# EAGLE design carte_decodeur (EAGLE 6.1)
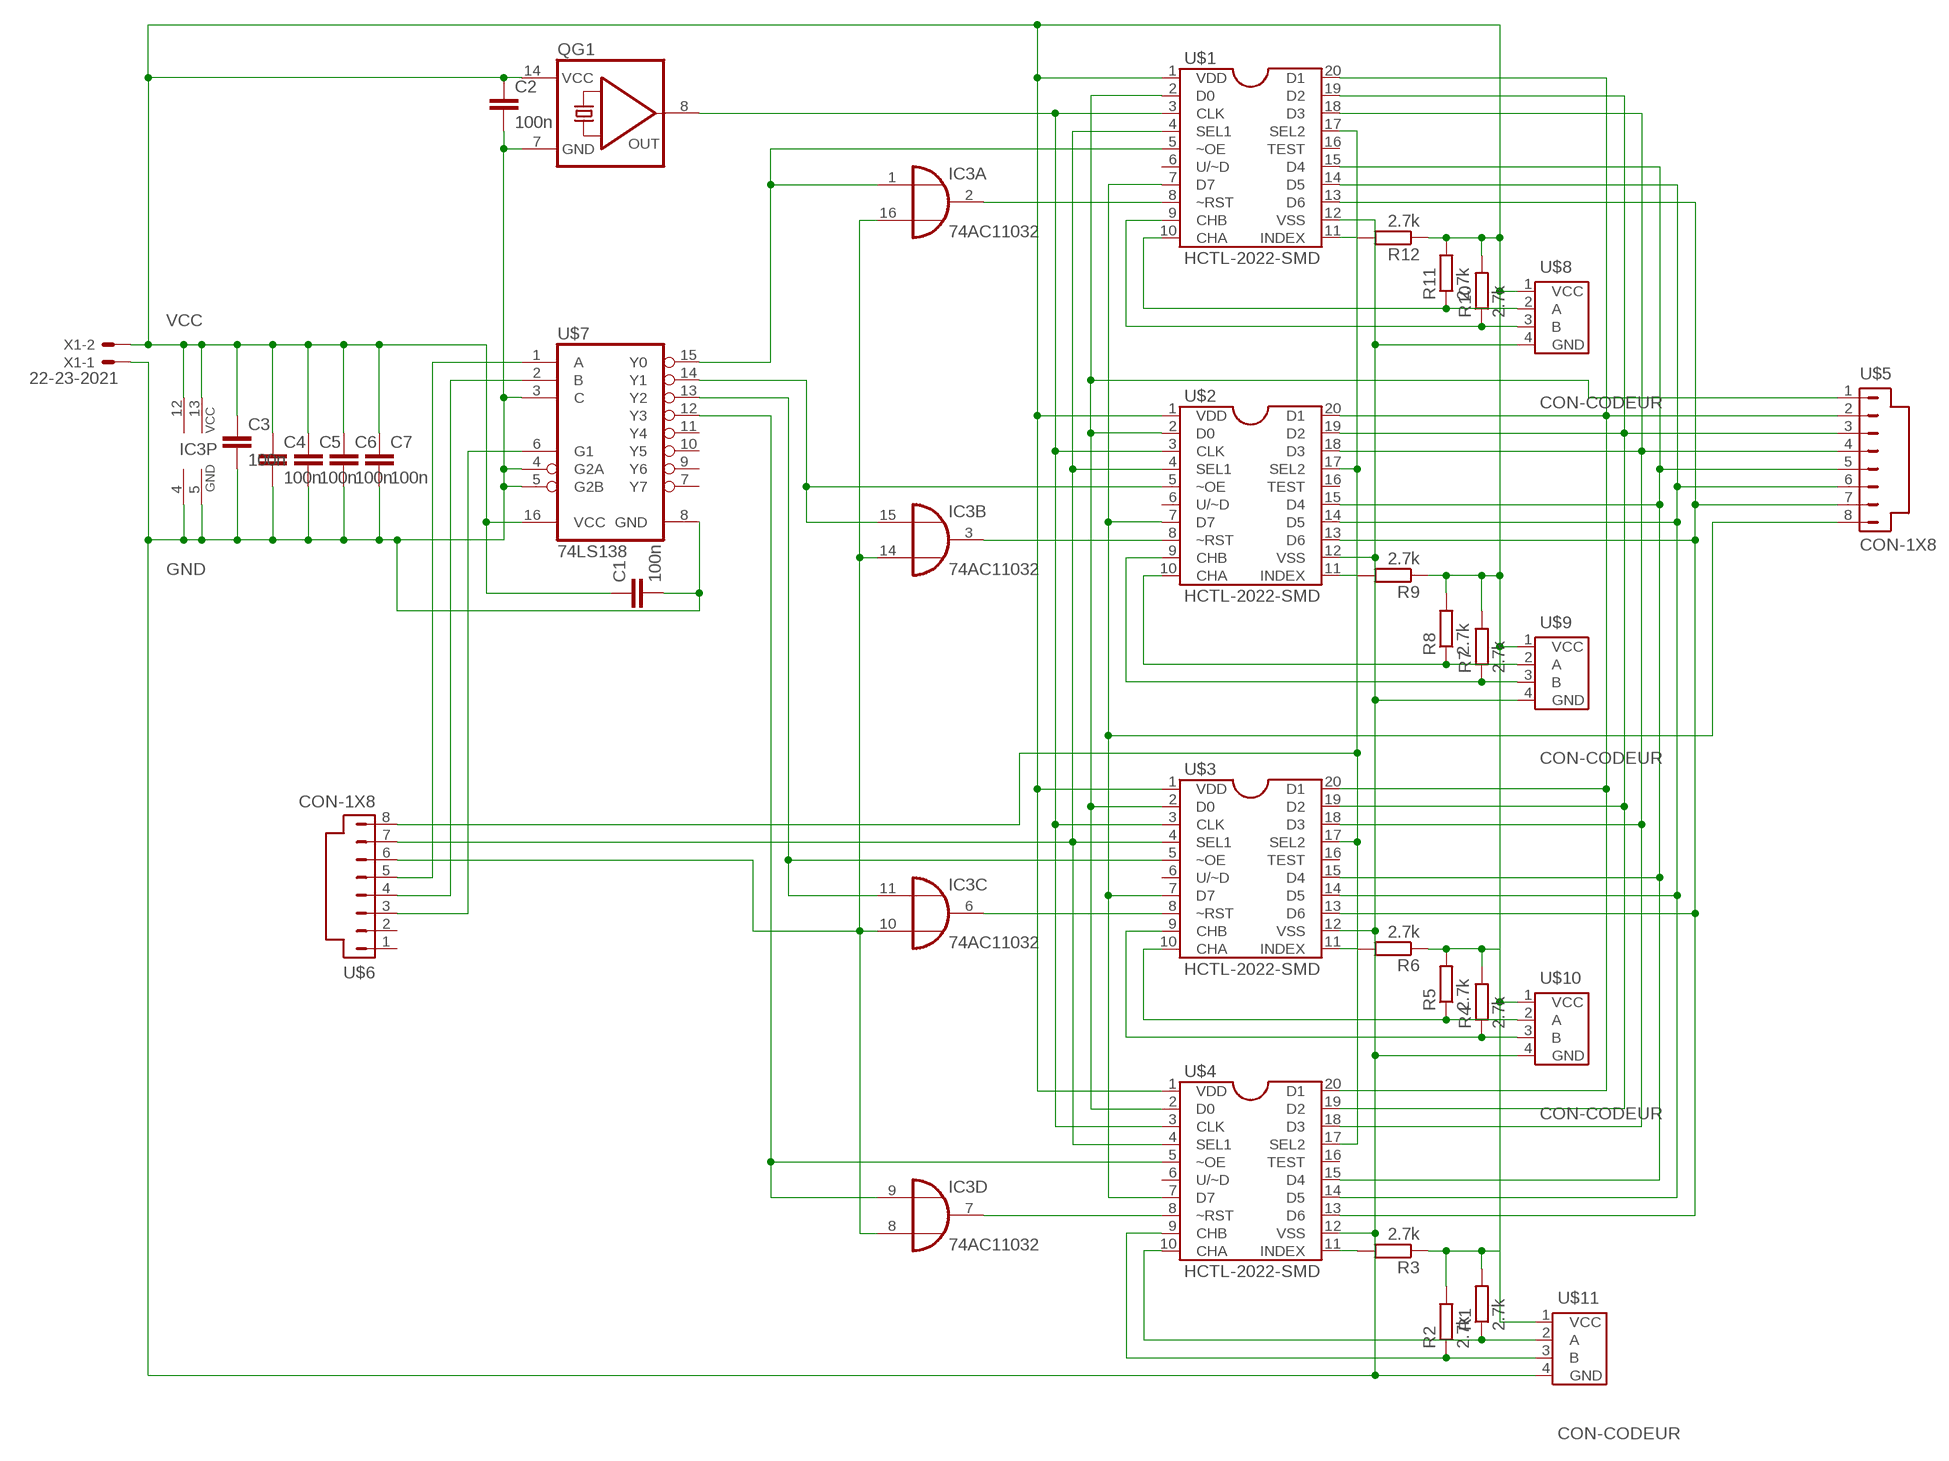
[diagram p0: schematic, sheet 1]

## Parts
C1  100n  C-EUC0805  [C0805]
C2  100n  C-EUC0805  [C0805]
C3  100n  C-EUC0805  [C0805]
C4  100n  C-EUC0805  [C0805]
C5  100n  C-EUC0805  [C0805]
C6  100n  C-EUC0805  [C0805]
C7  100n  C-EUC0805  [C0805]
IC3  74AC11032  [DIL16]
QG1  QG5860  [DIL14S]
R1  2.7k  R-EU_R0805  [R0805]
R2  2.7k  R-EU_R0805  [R0805]
R3  2.7k  R-EU_R0805  [R0805]
R4  2.7k  R-EU_R0805  [R0805]
R5  2.7k  R-EU_R0805  [R0805]
R6  2.7k  R-EU_R0805  [R0805]
R7  2.7k  R-EU_R0805  [R0805]
R8  2.7k  R-EU_R0805  [R0805]
R9  2.7k  R-EU_R0805  [R0805]
R10  2.7k  R-EU_R0805  [R0805]
R11  2.7k  R-EU_R0805  [R0805]
R12  2.7k  R-EU_R0805  [R0805]
U$1  HCTL-2022-SMD  [DIL20-SMD]
U$2  HCTL-2022-SMD  [DIL20-SMD]
U$3  HCTL-2022-SMD  [DIL20-SMD]
U$4  HCTL-2022-SMD  [DIL20-SMD]
U$5  CON-1X8  [CON-1X8]
U$6  CON-1X8  [CON-1X8]
U$7  74LS138  [DIL16]
U$8  CON-CODEUR  [CON-1X4]
U$9  CON-CODEUR  [CON-1X4]
U$10  CON-CODEUR  [CON-1X4]
U$11  CON-CODEUR  [CON-1X4]
X1  22-23-2021  [22-23-2021]

## Nets
GND: C1.2 C2.2 C3.2 C4.2 C5.2 C6.2 C7.2 IC3.4(P:GND) IC3.5(P:GND) QG1.7(GND) U$1.12(VSS) U$2.12(VSS) U$3.12(VSS) U$4.12(VSS) U$7.3(C) U$7.4(G2A) U$7.5(G2B) U$7.8(GND) U$8.4(GND) U$9.4(GND) U$10.4(GND) U$11.4(GND) X1.1
N$1: U$1.15(D4) U$2.15(D4) U$3.15(D4) U$4.15(D4) U$5.5
N$2: U$1.19(D2) U$2.19(D2) U$3.19(D2) U$4.19(D2) U$5.3
N$3: U$1.18(D3) U$2.18(D3) U$3.18(D3) U$4.18(D3) U$5.4
N$4: IC3.1(A:I1) U$1.5(~OE) U$7.15(Y0)
N$5: IC3.15(B:I1) U$2.5(~OE) U$7.14(Y1)
N$6: U$1.13(D6) U$2.13(D6) U$3.13(D6) U$4.13(D6) U$5.7
N$7: U$1.7(D7) U$2.7(D7) U$3.7(D7) U$4.7(D7) U$5.8
N$8: U$1.2(D0) U$2.2(D0) U$3.2(D0) U$4.2(D0) U$5.1
N$9: U$1.20(D1) U$2.20(D1) U$3.20(D1) U$4.20(D1) U$5.2
N$10: IC3.11(C:I1) U$3.5(~OE) U$7.13(Y2)
N$11: IC3.9(D:I1) U$4.5(~OE) U$7.12(Y3)
N$12: U$1.4(SEL1) U$2.4(SEL1) U$3.4(SEL1) U$4.4(SEL1) U$6.7
N$13: U$1.17(SEL2) U$2.17(SEL2) U$3.17(SEL2) U$4.17(SEL2) U$6.8
N$14: U$1.14(D5) U$2.14(D5) U$3.14(D5) U$4.14(D5) U$5.6
N$15: U$6.5 U$7.1(A)
N$16: U$6.4 U$7.2(B)
N$17: IC3.7(D:O) U$4.8(~RST)
N$18: IC3.6(C:O) U$3.8(~RST)
N$19: IC3.3(B:O) U$2.8(~RST)
N$20: IC3.2(A:O) U$1.8(~RST)
N$21: U$6.3 U$7.6(G1)
N$22: IC3.8(D:I2) IC3.10(C:I2) IC3.14(B:I2) U$6.6
N$23: R1.1 U$4.10(CHA) U$11.2(A)
N$24: R2.1 U$4.9(CHB) U$11.3(B)
N$25: QG1.8(OUT) U$1.3(CLK) U$2.3(CLK) U$3.3(CLK) U$4.3(CLK)
N$26: R3.2 U$4.11(INDEX)
N$27: R5.1 U$3.10(CHA) U$10.2(A)
N$28: R4.1 U$3.9(CHB) U$10.3(B)
N$29: R6.2 U$3.11(INDEX)
N$30: R9.2 U$2.11(INDEX)
N$31: R8.1 U$2.10(CHA) U$9.2(A)
N$32: R7.1 U$2.9(CHB) U$9.3(B)
N$33: R12.2 U$1.11(INDEX)
N$35: R11.1 U$1.10(CHA) U$8.2(A)
N$39: R10.1 U$1.9(CHB) U$8.3(B)
VCC: C1.1 C2.1 C3.1 C4.1 C5.1 C6.1 C7.1 IC3.12(P:VCC) IC3.13(P:VCC) QG1.14(VCC) R1.2 R2.2 R3.1 R4.2 R5.2 R6.1 R7.2 R8.2 R9.1 R10.2 R11.2 R12.1 U$1.1(VDD) U$2.1(VDD) U$3.1(VDD) U$4.1(VDD) U$7.16(VCC) U$8.1(VCC) U$9.1(VCC) U$10.1(VCC) U$11.1(VCC) X1.2
Unconnected: IC3.16(A:I2) U$1.6(U/~D) U$1.16(TEST) U$2.6(U/~D) U$2.16(TEST) U$3.6(U/~D) U$3.16(TEST) U$4.6(U/~D) U$4.16(TEST) U$6.1 U$6.2 U$7.7(Y7) U$7.9(Y6) U$7.10(Y5) U$7.11(Y4)

## Library data of the parts
C1-C7 = rcl:C-EU: CAPACITOR, European symbol
IC3 = 74ac-logic:74AC11032: Quadruple 2-input OR
QG1 = crystal:QG5860: CRYSTAL RESONATOR; OC_FARNELL: unknown; OC_NEWARK: unknown
R1-R12 = rcl:R-EU_: RESISTOR, European symbol
U$1-U$4 = neobot:HCTL-2022-SMD
U$5 U$6 = neobot:CON-1X8
U$7 = neobot:74LS138
U$8-U$11 = neobot:CON-CODEUR
X1 = con-molex:22-23-2021: .100" (2.54mm) Center Header - 2 Pin; MF: MOLEX; MPN: 22-23-2021; OC_FARNELL: 1462926; OC_NEWARK: 25C3832

## Board
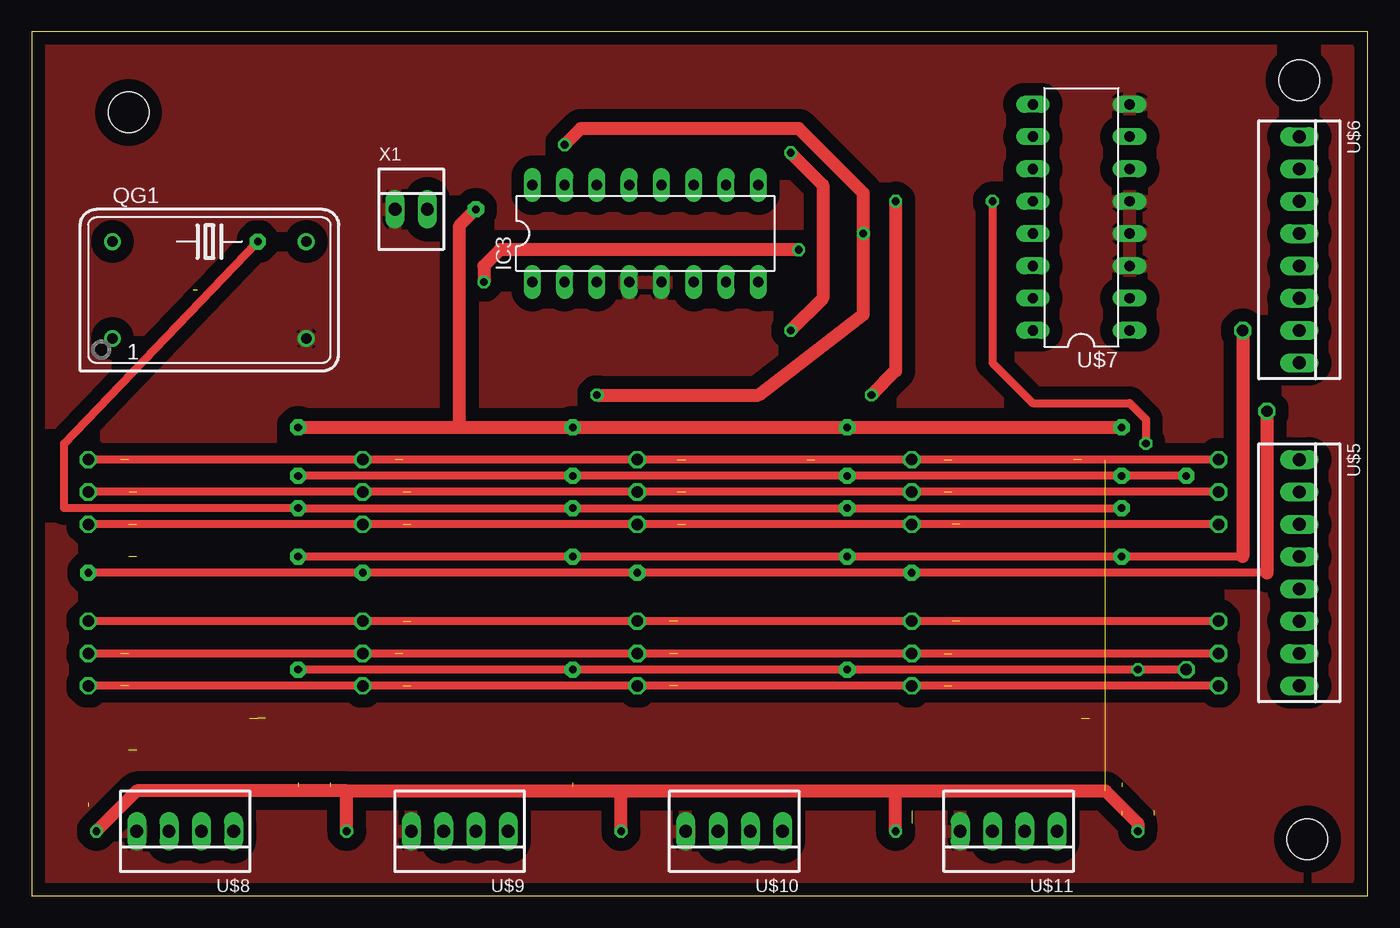
[diagram p1: board, top side]
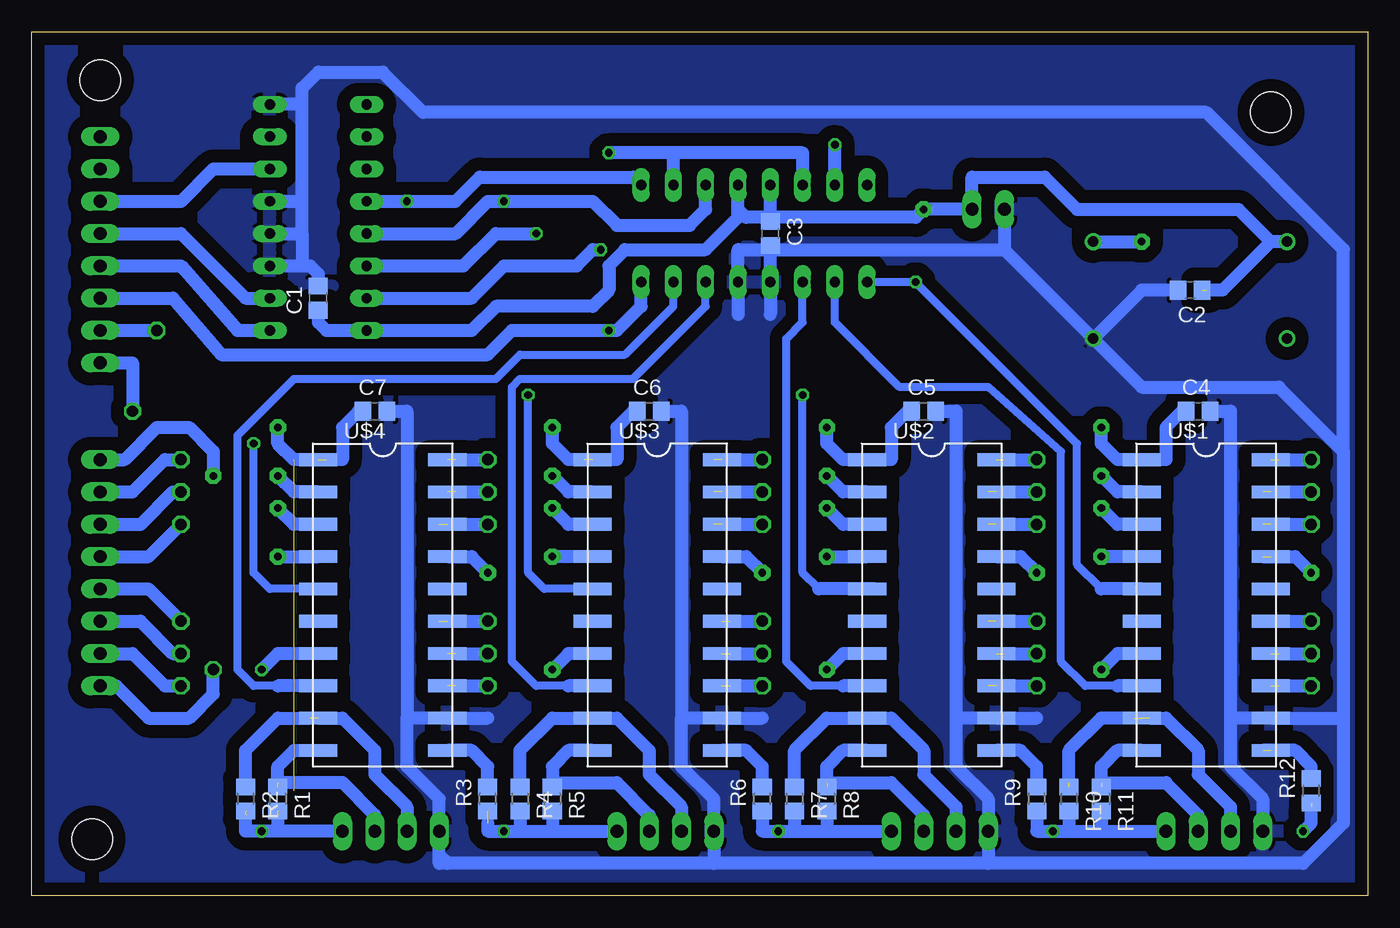
[diagram p2: board, bottom side, seen from below]

Size 105.08 x 67.94 mm. Coordinates in mm from the lower left corner, seen from the top.
Outline: 0,0 105.08,0 105.08,67.94 0,67.94 0,0
Copper layers (1*16): Top 0.035mm / dielectric 1.5mm / Bottom 0.035mm
Design rules: minimum track width 10mil, minimum drill 24mil, track to track 8mil, track to pad 8mil, pad to pad 8mil, via to via 8mil, smd to smd 8mil, copper to edge 40mil, drill to drill 8mil, minimum pad ring 10mil, minimum via ring 8mil, stop-mask expansion 4mil, vias tented up to drill 0mil, thermal gap 10mil
Holes 3.2 mm at 100.33,4.45 99.69,64.14 7.62,61.59

### Footprints (pad centres in the part's own frame; a part is rotated, then mirrored left to right if it is on the bottom)
C0805 = smd 1.3 x 1.5: 1 -0.95,0; 2 0.95,0
DIL16 = drill 0.813 long: 1 -8.89,-3.81; 2 -6.35,-3.81; 3 -3.81,-3.81; 4 -1.27,-3.81; 5 1.27,-3.81; 6 3.81,-3.81; 7 6.35,-3.81; 8 8.89,-3.81; 9 8.89,3.81; 10 6.35,3.81; 11 3.81,3.81; 12 1.27,3.81; 13 -1.27,3.81; 14 -3.81,3.81; 15 -6.35,3.81; 16 -8.89,3.81
DIL14S = drill 0.813: 1 -7.62,-3.81; 7 7.62,-3.81; 8 7.62,3.81; 14 -7.62,3.81
R0805 = smd 1.3 x 1.5: 1 -0.95,0; 2 0.95,0
DIL20-SMD = smd 1 x 3: 1 -11.43,-5.08; 2 -8.89,-5.08; 3 -6.35,-5.08; 4 -3.81,-5.08; 5 -1.27,-5.08; 6 1.27,-5.08; 7 3.81,-5.08; 8 6.35,-5.08; 9 8.89,-5.08; 10 11.43,-5.08; 11 11.43,5.08; 12 8.89,5.08; 13 6.35,5.08; 14 3.81,5.08; 15 1.27,5.08; 16 -1.27,5.08; 17 -3.81,5.08; 18 -6.35,5.08; 19 -8.89,5.08; 20 -11.43,5.08; P$2 11.43,5.08
CON-1X8 = drill 1 long: 1 -8.89,0; 2 -6.35,0; 3 -3.81,0; 4 -1.27,0; 5 1.27,0; 6 3.81,0; 7 6.35,0; 8 8.89,0
CON-1X4 = drill 1 long: 1 -3.81,0; 2 -1.27,0; 3 1.27,0; 4 3.81,0
22-23-2021 = drill 1 long: 1 -1.27,0; 2 1.27,0

### Placement (x,y rotation side)
C1  82.55,46.99 90 bottom
C2  13.97,47.62 180 bottom
C3  46.99,52.07 270 bottom
C4  13.34,38.1 0 bottom
C5  34.92,38.1 0 bottom
C6  56.52,38.1 0 bottom
C7  78.11,38.1 0 bottom
IC3  48.26,52.07 0 top
QG1  13.97,47.62 0 top
R1  85.72,7.62 270 bottom
R2  88.27,7.62 270 bottom
R3  69.22,7.62 90 bottom
R4  66.67,7.62 270 bottom
R5  64.14,7.62 270 bottom
R6  47.62,7.62 90 bottom
R7  45.09,7.62 270 bottom
R8  42.55,7.62 270 bottom
R9  26.04,7.62 90 bottom
R10  23.5,7.62 270 bottom
R11  20.95,7.62 270 bottom
R12  4.45,8.26 90 bottom
U$1  12.7,22.86 270 bottom
U$2  34.29,22.86 270 bottom
U$3  55.88,22.86 270 bottom
U$4  77.47,22.86 270 bottom
U$5  99.69,25.4 270 top
U$6  99.69,50.8 270 top
U$7  82.55,53.34 90 top
U$8  12.06,5.08 180 top
U$9  33.66,5.08 180 top
U$10  55.24,5.08 180 top
U$11  76.83,5.08 180 top
X1  29.84,53.98 0 top

### Tracks (layer width: path | path; a pad name or v marks a point on that pad's centre or on a via)
GND
  Bottom 1.016: U$8.4 8.26,7.62 10.79,10.16 10.79,13.97 | 10.79,13.97 U$1.12 1.91,13.97 | 32.38,13.97 U$2.12 26.04,13.97 | 32.38,13.97 32.38,10.16 29.84,7.62 U$9.4 29.84,2.54 | 53.98,13.97 U$3.12 47.62,13.97 | 53.98,13.97 53.98,10.16 51.44,7.62 U$10.4 51.44,2.54 | 75.56,13.97 75.56,10.16 73.03,7.62 U$11.4 73.03,3.17 | 1.91,13.97 1.91,5.71 5.08,2.54 29.84,2.54 | 29.84,2.54 51.44,2.54 | 51.44,2.54 72.39,2.54 | 72.39,2.54 73.03,2.54 73.03,3.17 | 75.56,13.97 U$4.12 69.22,13.97 | C3.2 IC3.4 46.99,45.72 | C3.2 46.67,50.8 28.57,50.8 | X1.1 28.57,50.8 | 28.57,50.8 QG1.7 | 1.91,34.92 1.91,13.97 | C2.2 17.78,47.62 QG1.7 | U$7.3 83.82,49.53 | 83.82,49.53 83.19,49.53 82.55,48.9 82.55,48.26 | C3.2 47.31,50.8 49.53,50.8 IC3.5 49.53,45.72 | 83.82,52.07 83.82,54.61 | U$7.5 83.82,54.61 | 83.82,54.61 83.82,62.23 | 83.82,62.23 U$7.8 | U$7.4 83.82,52.07 | 83.82,52.07 83.82,49.53 | C4.2 10.79,38.1 10.79,13.97 | C5.2 32.38,38.1 32.38,13.97 | C6.2 53.98,38.1 53.98,13.97 | C7.2 75.56,38.1 75.56,13.97 | 83.82,62.23 83.82,63.5 82.55,64.77 77.47,64.77 74.3,61.59 12.7,61.59 1.91,50.8 1.91,34.92 | QG1.7 17.78,40.01 6.99,40.01 1.91,34.92 | 73.03,3.17 72.39,2.54
  pour Bottom (isolate 1.016): 0,0 0,67.94 104.78,67.94 104.78,0
  pour Top (isolate 1.016): 1.27,1.27 1.27,66.67 103.5,66.67 103.5,1.27
N$1  (via drill 0.9 pad 0.25)  (3 unrouted)
  Top 0.61: v93.34,21.59 v69.22,21.59 v47.62,21.59 v26.04,21.59 v4.45,21.59
  Bottom 1.016: U$5.5 95.89,24.13 v93.34,21.59 | 8.26,21.59 U$1.15 v4.45,21.59 | 29.84,21.59 v26.04,21.59 | 50.16,21.59 v47.62,21.59 | 73.03,21.59 v69.22,21.59
N$2  (via drill 0.9 pad 0.25)  (4 unrouted)
  Top 0.61: v93.34,31.75 v69.22,31.75 v47.62,31.75 v26.04,31.75 v4.45,31.75
  Bottom 1.016: U$5.3 96.52,29.21 93.98,31.75 v93.34,31.75 | 71.75,31.75 v69.22,31.75 | 51.44,31.75 v47.62,31.75 | 29.84,31.75 v26.04,31.75 | 8.26,31.75 v4.45,31.75
N$3  (via drill 0.9 pad 0.25)  (4 unrouted)
  Top 0.61: v93.34,29.21 v69.22,29.21 v47.62,29.21 v26.04,29.21 v4.45,29.21
  Bottom 1.016: U$5.4 95.89,26.67 v93.34,29.21 | 8.26,29.21 v4.45,29.21 | 29.84,29.21 v26.04,29.21 | 51.44,29.21 v47.62,29.21 | 73.03,29.21 v69.22,29.21
N$4  (via drill 0.6)
  Top 1.016: v60.33,50.8 36.83,50.8 35.56,49.53 v35.56,48.26
  Bottom 0.61: 20.95,24.13 22.86,26.04 22.86,35.56 v35.56,48.26 IC3.1
  Bottom 1.016: U$7.15 70.48,46.99 67.94,49.53 62.23,49.53 60.96,50.8 v60.33,50.8 | U$1.5 20.95,24.13
N$5  (via drill 0.6)
  Top 1.016: v44.45,39.37 57.15,39.37 65.41,45.72 v65.41,52.07 65.41,55.24 60.33,60.33 43.18,60.33 v41.91,59.05
  Bottom 0.61: U$2.5 43.18,24.13 44.45,25.4 v44.45,39.37
  Bottom 1.016: IC3.15 v41.91,59.05 | U$7.14 71.12,49.53 68.58,52.07 v65.41,52.07 | 38.73,24.13 43.18,24.13
N$6  (via drill 0.9 pad 0.25)  (4 unrouted)
  Top 0.61: v93.34,16.51 v69.22,16.51 v47.62,16.51 v26.04,16.51 v4.45,16.51
  Bottom 1.016: U$5.7 97.16,19.05 94.61,16.51 v93.34,16.51 | 6.99,16.51 v4.45,16.51 | 29.84,16.51 v26.04,16.51 | 50.16,16.51 v47.62,16.51 | 71.75,16.51 v69.22,16.51
N$7  (via drill 0.6, 0.6 pad 1.27, 0.9 pad 0.25)
  Top 0.61: v90.81,17.78 v87,17.78 v64.14,17.78 v42.55,17.78 v20.95,17.78
  Bottom 1.016: U$5.8 98.42,16.51 95.89,13.97 92.71,13.97 90.81,15.88 v90.81,17.78 | U$3.7 62.87,19.05 v64.14,17.78 | U$2.7 41.27,19.05 v42.55,17.78 | U$1.7 19.68,19.05 v20.95,17.78 | U$4.7 85.72,19.05 v87,17.78
N$8  (via drill 0.6 pad 1.27)
  Top 0.61: v90.81,33.02 v85.72,33.02 v64.14,33.02 v42.55,33.02 v20.95,33.02
  Bottom 1.016: U$5.1 97.79,34.29 95.25,36.83 92.71,36.83 90.81,34.92 v90.81,33.02 | U$1.2 19.68,31.75 v20.95,33.02 | U$2.2 41.27,31.75 v42.55,33.02 | U$3.2 62.87,31.75 v64.14,33.02 | U$4.2 84.45,31.75 v85.72,33.02
N$9  (via drill 0.9 pad 0.25)  (4 unrouted)
  Top 0.61: v93.34,34.29 v69.22,34.29 v47.62,34.29 v26.04,34.29 v4.45,34.29
  Bottom 1.016: U$5.2 97.16,31.75 94.61,34.29 v93.34,34.29 | 6.99,34.29 v4.45,34.29 | 28.57,34.29 v26.04,34.29 | 51.44,34.29 v47.62,34.29 | 71.75,34.29 v69.22,34.29
N$10  (via drill 0.6)
  Top 1.016: v67.94,54.61 67.94,41.27 v66.04,39.37
  Bottom 0.61: U$3.5 64.77,24.13 66.04,25.4 v66.04,39.37
  Bottom 1.016: IC3.11 52.07,53.98 53.34,52.7 59.05,52.7 60.96,54.61 v67.94,54.61 69.22,54.61 71.75,52.07 U$7.13
N$11  (via drill 0.6)
  Top 0.61: v75.56,54.61 75.56,41.91 78.74,38.73 86.36,38.73 87.63,37.47 v87.63,35.56
  Bottom 0.61: U$4.5 86.36,24.13 87.63,25.4 v87.63,35.56
  Bottom 1.016: U$7.12 v75.56,54.61 71.75,54.61 69.85,56.52 57.78,56.52 IC3.9
N$12  (via drill 0.6 pad 1.27, 0.9 pad 0.25)
  Top 0.61: 95.25,26.67 v85.72,26.67 v64.14,26.67 v42.55,26.67 v20.95,26.67
  Top 1.016: v95.25,44.45 95.25,26.67
  Bottom 1.016: U$6.7 v95.25,44.45 | U$1.4 v20.95,26.67 | U$3.4 v64.14,26.67 | v85.72,26.67 U$4.4 | v42.55,26.67 U$2.4
N$13  (via drill 0.6 pad 1.27, 0.9 pad 0.25)  (1 unrouted)
  Top 0.61: 97.16,25.4 v69.22,25.4 v47.62,25.4 v26.04,25.4 v4.45,25.4
  Top 1.016: v97.16,38.1 97.16,25.4
  Bottom 1.016: U$6.8 97.16,41.91 v97.16,38.1 | 8.26,26.67 5.71,26.67 v4.45,25.4 | U$2.17 27.3,26.67 v26.04,25.4 | U$3.17 48.9,26.67 v47.62,25.4 | U$4.17 70.48,26.67 v69.22,25.4
N$14  (via drill 0.9 pad 0.25)  (4 unrouted)
  Top 0.61: v93.34,19.05 v69.22,19.05 v47.62,19.05 v26.04,19.05 v4.45,19.05
  Bottom 1.016: U$5.6 96.52,21.59 93.98,19.05 v93.34,19.05 | 6.99,19.05 v4.45,19.05 | 28.57,19.05 v26.04,19.05 | 50.16,19.05 v47.62,19.05 | 71.75,19.05 v69.22,19.05
N$15
  Bottom 1.016: U$6.5 93.34,49.53 88.9,44.45 U$7.1
N$16
  Bottom 1.016: U$6.4 93.34,52.07 88.27,46.99 U$7.2
N$17
  Bottom 0.61: 85.72,16.51 87.63,16.51 88.9,17.78 88.9,36.2 84.45,40.64 68.58,40.64 66.67,42.55 58.42,42.55 54.61,46.35 IC3.7
  Bottom 1.016: U$4.8 85.72,16.51
N$18
  Bottom 0.61: 62.87,16.51 65.41,16.51 67.31,18.41 67.31,40.01 66.67,40.64 57.78,40.64 52.07,46.35 IC3.6
  Bottom 1.016: U$3.8 62.87,16.51
N$19
  Bottom 0.61: 41.27,16.51 43.81,16.51 45.72,18.41 45.72,43.81 44.45,45.09 IC3.3
  Bottom 1.016: U$2.8 41.27,16.51
N$20
  Bottom 0.61: 19.68,16.51 22.23,16.51 24.13,18.41 24.13,34.92 29.84,40.01 36.83,40.01 41.91,45.09 IC3.2
  Bottom 1.016: U$1.8 19.68,16.51
N$21
  Bottom 1.016: U$6.3 93.34,54.61 90.81,57.15 U$7.6
N$22  (via drill 0.6)
  Top 1.016: v59.69,58.42 62.23,55.88 62.23,46.99 v59.69,44.45
  Bottom 1.016: U$6.6 93.98,46.99 90.17,42.55 69.22,42.55 67.31,44.45 v59.69,44.45 59.05,44.45 57.15,46.35 IC3.8 | IC3.14 44.45,58.42 54.61,58.42 | IC3.10 54.61,58.42 | 54.61,58.42 v59.69,58.42
N$23  (1 unrouted)
  Bottom 1.016: U$11.2 78.11,6.35 80.64,8.89 85.72,8.89 85.72,10.16 84.45,11.43 U$4.10
N$24  (1 unrouted)
  Bottom 1.016: U$4.9 80.64,13.97 78.11,11.43 78.11,9.53 75.56,6.99 U$11.3 | R2.1 88.27,11.43 85.72,13.97 83.19,13.97
N$25  (via drill 0.6 pad 1.27)
  Top 0.61: v85.72,30.48 v64.14,30.48 v42.55,30.48 v20.95,30.48 2.54,30.48 2.54,35.56 v17.78,51.44
  Bottom 1.016: QG1.8 v17.78,51.44 | U$1.3 19.68,29.21 v20.95,30.48 | U$2.3 41.27,29.21 v42.55,30.48 | U$3.3 62.87,29.21 v64.14,30.48 | U$4.3 84.45,29.21 v85.72,30.48
N$26
  Bottom 1.016: R3.2 69.22,10.16 70.48,11.43 U$4.11
N$27
  Bottom 1.016: U$3.10 62.87,11.43 64.14,10.16 64.14,8.89 | 64.14,8.89 59.05,8.89 56.52,6.35 U$10.2 | 64.14,8.89 R5.1
N$28
  Bottom 1.016: U$10.3 53.98,6.99 56.52,9.53 56.52,11.43 59.05,13.97 U$3.9 64.14,13.97 66.67,11.43 R4.1
N$29
  Bottom 1.016: R6.2 47.62,10.16 48.9,11.43 U$3.11
N$30
  Bottom 1.016: R9.2 26.04,10.16 27.3,11.43 U$2.11
N$31  (1 unrouted)
  Bottom 1.016: U$2.10 41.27,11.43 42.55,10.16 42.55,8.89 37.47,8.89 34.92,6.35 U$9.2
N$32
  Bottom 1.016: U$9.3 32.38,6.99 34.92,9.53 34.92,11.43 37.47,13.97 U$2.9 42.55,13.97 45.09,11.43 R7.1
N$33  (1 unrouted)
  Bottom 1.016: R12.2 4.45,10.16 5.71,11.43 8.26,11.43
N$35  (1 unrouted)
  Bottom 1.016: U$1.10 19.68,11.43 20.95,10.16 20.95,8.89 15.88,8.89 13.34,6.35 U$8.2
N$39  (3 unrouted)
  Bottom 1.016: 17.14,13.97 15.88,13.97 13.34,11.43 13.34,9.53 10.79,6.99 U$8.3 | 23.5,8.89 23.5,11.43 20.95,13.97 18.41,13.97
VCC  (via drill 0.6, 0.6 pad 1.27)  (8 unrouted)
  Top 1.016: v20.95,36.83 33.66,36.83 | 33.66,36.83 v42.55,36.83 v64.14,36.83 v85.72,36.83 | v24.77,5.08 24.77,8.26 | 24.77,8.26 46.35,8.26 | 46.35,8.26 67.94,8.26 | 67.94,8.26 84.45,8.26 87,5.71 v87,5.08 | v67.94,5.08 67.94,8.26 | v46.35,5.08 46.35,8.26 | 24.77,8.26 8.26,8.26 v5.08,5.08 | 33.66,36.83 33.66,52.7 v34.92,53.98
  Bottom 1.016: U$11.1 85.72,5.08 | 85.72,5.08 v87,5.08 88.27,5.08 88.27,6.35 | 85.72,6.35 85.72,5.08 | 69.22,5.71 69.22,5.08 v67.94,5.08 66.67,5.08 | 66.67,5.08 64.14,5.08 | 64.14,5.08 U$10.1 | R4.2 66.67,5.08 | R5.2 64.14,5.08 | R8.2 42.55,5.08 | 42.55,5.08 U$9.1 | R7.2 45.09,5.08 | 45.09,5.08 42.55,5.08 | R6.1 47.62,5.08 v46.35,5.08 45.09,5.08 | R11.2 20.95,5.08 | 20.95,5.08 U$8.1 | R10.2 23.5,5.08 | 23.5,5.08 20.95,5.08 | R9.1 26.04,5.08 v24.77,5.08 23.5,5.08 | C3.1 46.99,53.34 | 46.99,53.34 IC3.13 | QG1.14 7.62,51.44 | 7.62,51.44 11.43,47.62 12.7,47.62 | C1.1 82.55,45.09 81.92,44.45 U$7.16 70.48,44.45 68.58,46.35 60.96,46.35 59.69,47.62 59.69,49.53 58.42,50.8 52.07,50.8 49.53,53.34 49.53,53.98 | 46.99,53.34 35.56,53.34 v34.92,53.98 X1.2 31.11,56.52 25.4,56.52 22.86,53.98 10.16,53.98 7.62,51.44 | 46.99,53.34 48.9,53.34 49.53,53.98 | 49.53,53.98 IC3.12 | C4.1 14.61,38.1 15.88,36.83 15.88,34.29 U$1.1 | U$1.1 18.41,34.29 | C5.1 36.2,38.1 37.47,36.83 37.47,34.29 U$2.1 41.27,34.29 42.55,35.56 v42.55,36.83 | C6.1 57.78,38.1 59.05,36.83 59.05,34.29 U$3.1 | C7.1 79.38,38.1 80.64,36.83 80.64,34.29 81.92,34.29 | U$1.1 19.68,34.29 20.95,35.56 v20.95,36.83 | U$4.1 84.45,34.29 85.72,35.56 v85.72,36.83 | 61.59,34.29 62.87,34.29 64.14,35.56 v64.14,36.83 | v5.08,5.08 4.45,5.71 4.45,6.99